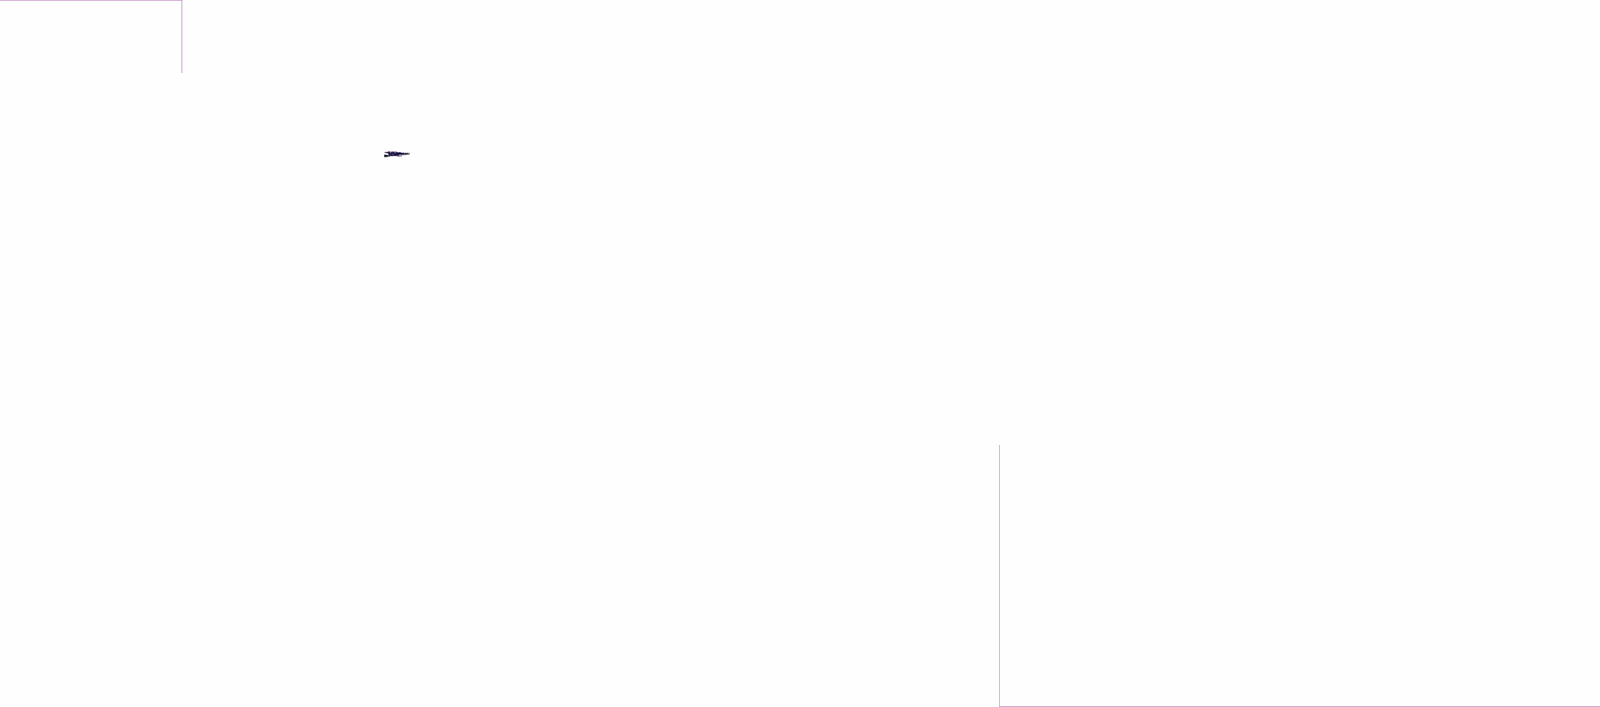
[diagram p0: schematic sheet, whole]
// Quartus schematic LogicCircuit.bdf as structural Verilog: 11 symbols, 9 pins
module LogicCircuit (
  input  Increment,
  output SevenSegment_A,
  output SevenSegment_B,
  output SevenSegment_C,
  output SevenSegment_D,
  output SevenSegment_E,
  output SevenSegment_F,
  output SevenSegment_G,
  output [3:0] Q
);

  wire inst3_rbon, inst11_1, inst13_1, inst14_1, inst15_1, inst20_1, inst21_1, inst22_1, inst_1;

  \7404  inst13 (.\2 (Q[0]), .\1 (inst13_1));
  \7404  inst15 (.\2 (Q[2]), .\1 (inst15_1));
  \7408  inst20 (.\3 (Q[1]), .\2 (inst13_1), .\1 (inst20_1));
  \7408  inst21 (.\3 (Q[3]), .\2 (inst15_1), .\1 (inst21_1));
  \7404  inst11 (.\2 (Increment), .\1 (inst11_1));
  \7408  inst22 (.\3 (inst21_1), .\2 (inst20_1), .\1 (inst22_1));
  \7476  inst0 (
    .\1J (inst3_rbon), .\1K (inst3_rbon), .\1PRN (inst3_rbon), .\2PRN (inst3_rbon), .\2J (Q[0]),
    .\1CLK (inst11_1), .\1CLRN (inst22_1), .\2K (Q[0]), .\2CLRN (inst22_1), .\2CLK (inst11_1), .\1Q (Q[0]),
    .\2Q (Q[1]));  // open: 2QN, 1QN
  \7408  inst (.\3 (Q[1]), .\2 (Q[0]), .\1 (inst_1));
  \7408  inst14 (.\3 (Q[2]), .\2 (inst_1), .\1 (inst14_1));
  \7476  inst1 (
    .\1J (inst_1), .\1K (inst_1), .\1PRN (inst3_rbon), .\2J (inst14_1), .\1CLK (inst11_1),
    .\1CLRN (inst22_1), .\2K (inst14_1), .\2CLRN (inst22_1), .\2CLK (inst11_1), .\1Q (Q[2]), .\2Q (Q[3]));  // open: 2PRN, 2QN, 1QN
  \7447  inst3 (
    .LTN(inst3_rbon), .B(Q[1]), .C(Q[2]), .D(Q[3]), .RBIN(inst3_rbon), .BIN(inst3_rbon), .A(Q[0]),
    .OB(SevenSegment_B), .OC(SevenSegment_C), .OE(SevenSegment_E), .OD(SevenSegment_D), .OF(SevenSegment_F),
    .OG(SevenSegment_G), .OA(SevenSegment_A), .RBON(inst3_rbon));
  // also tied to VCC on the sheet: inst3_rbon

  // Notes on the sheet:
  //   74HC08
  //   74HC14
  //   74HC08
  //   74HC14
  //   74HC08
endmodule
